# Altium schematic sheet Power.SchDoc: Power
size B; Organization: UCLA High Energy Physics; DocumentNumber: 9; Revision: 2.0; SheetNumber: 9; SheetTotal: 12; CurrentDate: 8/7/2018; ModifiedDate: 8/20/2018; Rule: PcbType=ProtelPcb
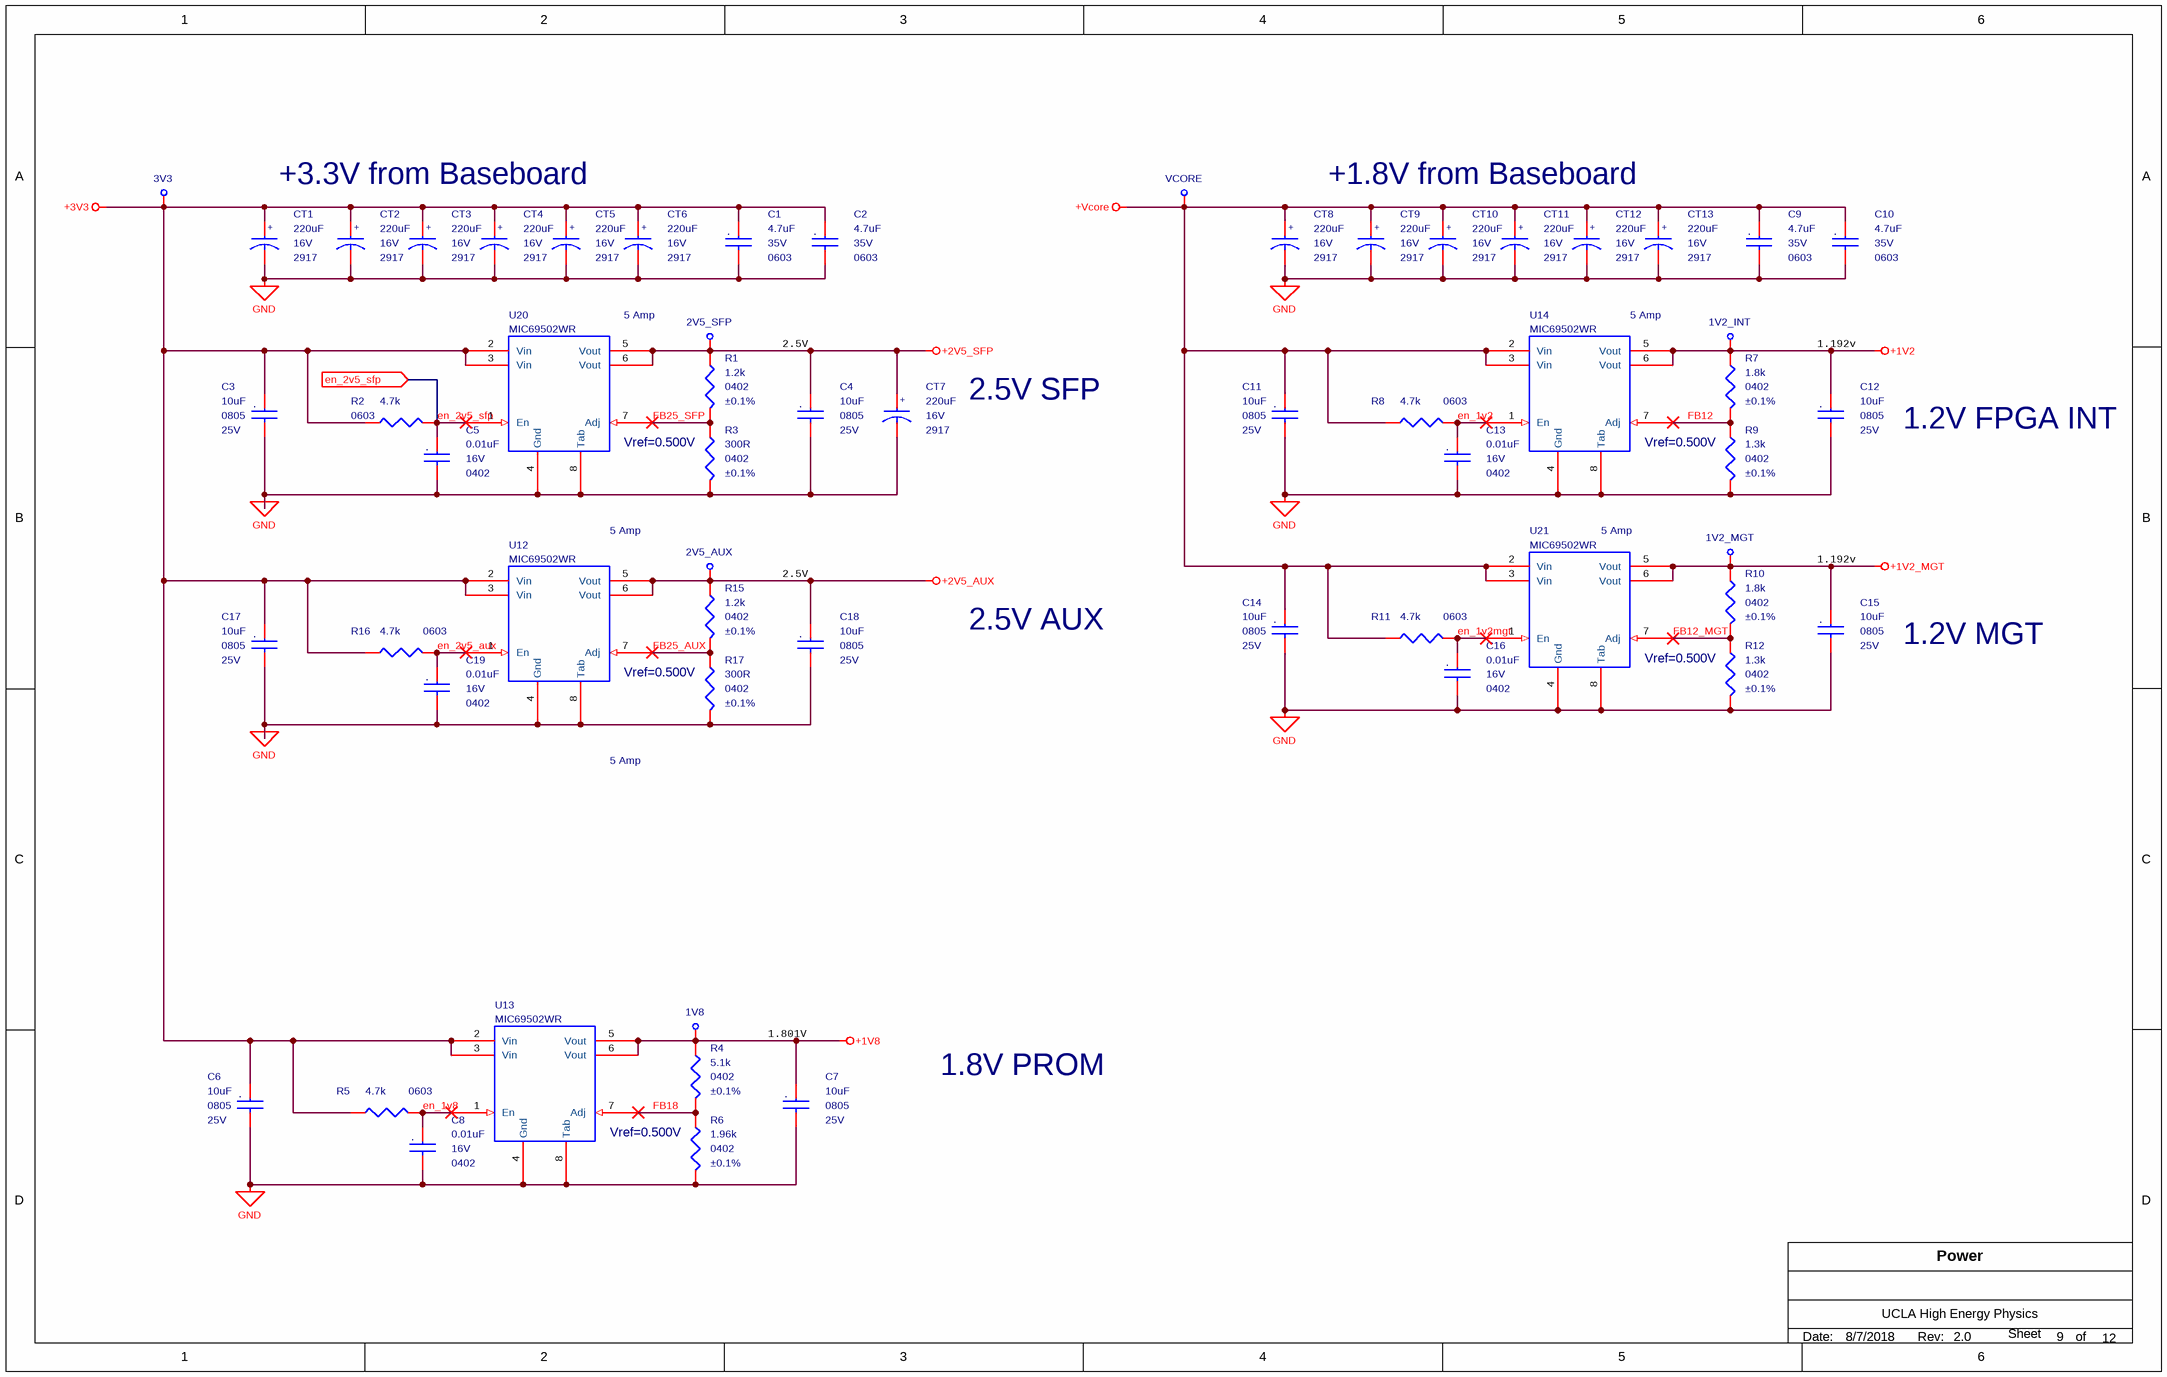
[diagram p0: Power.SchDoc]

## Parts
1V2_INT  Test Point Via  [MC_S6/TH/TPVIA]  (value not drawn)  (no BOM)
1V2_MGT  Test Point Via  [MC_S6/TH/TPVIA]  (value not drawn)  (no BOM)
1V8  Test Point Via  [MC_S6/TH/TPVIA]  (value not drawn)  (no BOM)
2V5_AUX  Test Point Via  [MC_S6/TH/TPVIA]  (value not drawn)  (no BOM)
2V5_SFP  Test Point Via  [MC_S6/TH/TPVIA]  (value not drawn)  (no BOM)
3V3  Test Point Via  [MC_S6/TH/TPVIA]  (value not drawn)  (no BOM)
C1  4.7uF  Voltage - Rated: 35V  package: 0603  [MC_S6/SM/C_0603_IPC]
C2  4.7uF  Voltage - Rated: 35V  package: 0603  [MC_S6/SM/C_0603_IPC]
C3  10uF  Voltage - Rated: 25V  package: 0805  [MC_S6/SM/C_0805_IPC]
C4  10uF  Voltage - Rated: 25V  package: 0805  [MC_S6/SM/C_0805_IPC]
C5  0.01uF  Voltage - Rated: 16V  package: 0402  [MC_S6/SM/C_0402_IPC]
C6  10uF  Voltage - Rated: 25V  package: 0805  [MC_S6/SM/C_0805_IPC]
C7  10uF  Voltage - Rated: 25V  package: 0805  [MC_S6/SM/C_0805_IPC]
C8  0.01uF  Voltage - Rated: 16V  package: 0402  [MC_S6/SM/C_0402_IPC]
C9  4.7uF  Voltage - Rated: 35V  package: 0603  [MC_S6/SM/C_0603_IPC]
C10  4.7uF  Voltage - Rated: 35V  package: 0603  [MC_S6/SM/C_0603_IPC]
C11  10uF  Voltage - Rated: 25V  package: 0805  [MC_S6/SM/C_0805_IPC]
C12  10uF  Voltage - Rated: 25V  package: 0805  [MC_S6/SM/C_0805_IPC]
C13  0.01uF  Voltage - Rated: 16V  package: 0402  [MC_S6/SM/C_0402_IPC]
C14  10uF  Voltage - Rated: 25V  package: 0805  [MC_S6/SM/C_0805_IPC]
C15  10uF  Voltage - Rated: 25V  package: 0805  [MC_S6/SM/C_0805_IPC]
C16  0.01uF  Voltage - Rated: 16V  package: 0402  [MC_S6/SM/C_0402_IPC]
C17  10uF  Voltage - Rated: 25V  package: 0805  [MC_S6/SM/C_0805_IPC]
C18  10uF  Voltage - Rated: 25V  package: 0805  [MC_S6/SM/C_0805_IPC]
C19  0.01uF  Voltage - Rated: 16V  package: 0402  [MC_S6/SM/C_0402_IPC]
CT1  220uF  Voltage - Rated: 16V  package: 2917  [MC_S6/SM/CT_2917_D]
CT2  220uF  Voltage - Rated: 16V  package: 2917  [MC_S6/SM/CT_2917_D]
CT3  220uF  Voltage - Rated: 16V  package: 2917  [MC_S6/SM/CT_2917_D]
CT4  220uF  Voltage - Rated: 16V  package: 2917  [MC_S6/SM/CT_2917_D]
CT5  220uF  Voltage - Rated: 16V  package: 2917  [MC_S6/SM/CT_2917_D]
CT6  220uF  Voltage - Rated: 16V  package: 2917  [MC_S6/SM/CT_2917_D]
CT7  220uF  Voltage - Rated: 16V  package: 2917  [MC_S6/SM/CT_2917_D]
CT8  220uF  Voltage - Rated: 16V  package: 2917  [MC_S6/SM/CT_2917_D]
CT9  220uF  Voltage - Rated: 16V  package: 2917  [MC_S6/SM/CT_2917_D]
CT10  220uF  Voltage - Rated: 16V  package: 2917  [MC_S6/SM/CT_2917_D]
CT11  220uF  Voltage - Rated: 16V  package: 2917  [MC_S6/SM/CT_2917_D]
CT12  220uF  Voltage - Rated: 16V  package: 2917  [MC_S6/SM/CT_2917_D]
CT13  220uF  Voltage - Rated: 16V  package: 2917  [MC_S6/SM/CT_2917_D]
R1  1.2k  Tolerance: ±0.1%  package: 0402  [MC_S6/SM/R_0402_IPC]
R2  4.7k  Supplier Device Package: 0603  [MC_S6/SM/R_0603_IPC]
R3  300R  Tolerance: ±0.1%  package: 0402  [MC_S6/SM/R_0402_IPC]
R4  5.1k  Tolerance: ±0.1%  Supplier Device Package: 0402  [MC_S6/SM/R_0402_IPC]
R5  4.7k  Supplier Device Package: 0603  [MC_S6/SM/R_0603_IPC]
R6  1.96k  Tolerance: ±0.1%  package: 0402  [MC_S6/SM/R_0402_IPC]
R7  1.8k  Tolerance: ±0.1%  package: 0402  [MC_S6/SM/R_0402_IPC]
R8  4.7k  Supplier Device Package: 0603  [MC_S6/SM/R_0603_IPC]
R9  1.3k  Tolerance: ±0.1%  Supplier Device Package: 0402  [MC_S6/SM/R_0402_IPC]
R10  1.8k  Tolerance: ±0.1%  Supplier Device Package: 0402  [MC_S6/SM/R_0402_IPC]
R11  4.7k  Supplier Device Package: 0603  [MC_S6/SM/R_0603_IPC]
R12  1.3k  Tolerance: ±0.1%  Supplier Device Package: 0402  [MC_S6/SM/R_0402_IPC]
R15  1.2k  Tolerance: ±0.1%  package: 0402  [MC_S6/SM/R_0402_IPC]
R16  4.7k  Supplier Device Package: 0603  [MC_S6/SM/R_0603_IPC]
R17  300R  Tolerance: ±0.1%  package: 0402  [MC_S6/SM/R_0402_IPC]
U12  MIC69502WR  [MC_S6/SM/SPAK7]
U13  MIC69502WR  [MC_S6/SM/SPAK7]
U14  MIC69502WR  [MC_S6/SM/SPAK7]
U20  MIC69502WR  [MC_S6/SM/SPAK7]
U21  MIC69502WR  [MC_S6/SM/SPAK7]
VCORE  Test Point Via  [MC_S6/TH/TPVIA]  (value not drawn)  (no BOM)

## Ports
en_2v5_sfp (in)

## Nets
+1V2: 1V2_INT.1(In) C12.1 R7.1 U14.5(Vout) U14.6(Vout)
+1V2_MGT: 1V2_MGT.1(In) C15.1 R10.1 U21.5(Vout) U21.6(Vout)
+1V8: 1V8.1(In) C7.1 R4.1 U13.5(Vout) U13.6(Vout)
+2V5_AUX: 2V5_AUX.1(In) C18.1 R15.1 U12.5(Vout) U12.6(Vout)
+2V5_SFP: 2V5_SFP.1(In) C4.1 CT7.1 R1.1 U20.5(Vout) U20.6(Vout)
+3V3: 3V3.1(In) C1.1 C2.1 C3.1 C6.1 C17.1 CT1.1 CT2.1 CT3.1 CT4.1 CT5.1 CT6.1 R2.1 R5.1 R16.1 U12.2(Vin) U12.3(Vin) U13.2(Vin) U13.3(Vin) U20.2(Vin) U20.3(Vin)
+Vcore: C9.1 C10.1 C11.1 C14.1 CT8.1 CT9.1 CT10.1 CT11.1 CT12.1 CT13.1 R8.1 R11.1 U14.2(Vin) U14.3(Vin) U21.2(Vin) U21.3(Vin) VCORE.1(In)
GND: C1.2 C2.2 C3.2 C4.2 C5.2 C6.2 C7.2 C8.2 C9.2 C10.2 C11.2 C12.2 C13.2 C14.2 C15.2 C16.2 C17.2 C18.2 C19.2 CT1.2 CT2.2 CT3.2 CT4.2 CT5.2 CT6.2 CT7.2 CT8.2 CT9.2 CT10.2 CT11.2 CT12.2 CT13.2 R3.2 R6.2 R9.2 R12.2 R17.2 U12.4(Gnd) U12.8(Tab) U13.4(Gnd) U13.8(Tab) U14.4(Gnd) U14.8(Tab) U20.4(Gnd) U20.8(Tab) U21.4(Gnd) U21.8(Tab)
en_1v2: C13.1 R8.2 U14.1(En)
en_1v2mgt: C16.1 R11.2 U21.1(En)
en_1v8: C8.1 R5.2 U13.1(En)
en_2v5_aux: C19.1 R16.2 U12.1(En)
en_2v5_sfp: C5.1 R2.2 U20.1(En) ; port en_2v5_sfp
FB12: R7.2 R9.1 U14.7(Adj)
FB12_MGT: R10.2 R12.1 U21.7(Adj)
FB18: R4.2 R6.1 U13.7(Adj)
FB25_AUX: R15.2 R17.1 U12.7(Adj)
FB25_SFP: R1.2 R3.1 U20.7(Adj)

## Notes on the sheet
- +3.3V from Baseboard
- +1.8V from Baseboard
- (near U20) 5 Amp
- (near U14) 5 Amp
- 2.5V
- 1.192v
- Vref=0.500V
- 2.5V SFP
- 1.2V FPGA INT
- (near U12) 5 Amp
- (near U21) 5 Amp
- 2.5V AUX
- 1.2V MGT
- 5 Amp
- 1.801V
- 1.8V PROM
- Date:
- Rev:
- of
- Sheet
- (in symbol C0402C103K4RACTU) .
- (in symbol GRM21BR61E106KA73L) .
- (in symbol GRM188R6YA475KE15D) .
- (in symbol T491D227K016AT) +

## Library data of the parts
1V2_INT 1V2_MGT 1V8 2V5_AUX 2V5_SFP 3V3 VCORE = TPVIA: COMPSIDE: TOP; COMPGROUP: 0; mfgr: Layout; COMPROT: 0; Package: 90; mfgr_id: TPVIA; mfgr_foot: TPVIA
C1 C2 C9 C10 = GRM188R6YA475KE15D: CAP CER 4.7UF 35V X5R 0603; Manufacturer: Murata; Capacitance: 4.7µF; Tolerance: ±10%; Product Training Modules: High-Cap Multilayer Ceramic Capacitors; Featured Product: GA3 Safety Recognized Capacitors; EDA / CAD Models: Download from Accelerated Designs; Online Catalog: GRM Series; Other Names: 490-7205-2; Supplier 1: Digikey; Manufacturer Part Number: GRM188R6YA475KE15D; Category: Capacitors; Stock 1: 180441; Pricing 1: 1=0.32, 10=0.264, 50=0.1486, 100=0.132, 250=0.099, 500=0.0875, 1000=0.0776 (USD); Packaging: Tape & Reel (TR); Operating Temperature: -55°C ~ 85°C; Mounting Type: Surface Mount, MLCC; Size / Dimension: 0.063" L x 0.031" W (1.60mm x 0.80mm); ComponentLink1URL: https://datasheet.ciiva.com/46444/1769893-46444984.pdf; ComponentLink1Description: https://datasheet.ciiva.com/46444/1769893-46444984.pdf; Supplier 2: Digikey; Stock 2: 180441; Pricing 2: 1=0.32, 10=0.264, 50=0.1486, 100=0.132, 250=0.099, 500=0.0875, 1000=0.0776 (USD); Supplier Part Number 1: 490-7205-1-ND; Supplier Part Number 2: 490-7205-6-ND; Package / Case: 0603 (1608 Metric); Standard Package: 4,000; Family: Ceramic Capacitors; Series: GRM; Temperature Coefficient: X5R; Applications: General Purpose; Thickness (Max): 0.031" (0.80mm); ComponentLink2URL: https://datasheet.ciiva.com/46444/1769893-46444985.pdf; ComponentLink2Description: https://datasheet.ciiva.com/46444/1769893-46444985.pdf; ComponentLink3URL: https://datasheet.ciiva.com/14906/partnumbering-e-01-14906426.pdf; ComponentLink3Description: https://datasheet.ciiva.com/14906/partnumbering-e-01-14906426.pdf; ComponentLink4URL: https://datasheet.ciiva.com/14906/partnumbering-e-01-14906427.pdf; ComponentLink4Description: https://datasheet.ciiva.com/14906/partnumbering-e-01-14906427.pdf; ComponentLink5URL: https://datasheet.ciiva.com/14906/partnumbering-e-01-14906428.pdf; ComponentLink5Description: https://datasheet.ciiva.com/14906/partnumbering-e-01-14906428.pdf
C3 C4 C6 C7 C11 C12 C14 C15 C17 C18 = GRM21BR61E106KA73L: CAP CER 10UF 25V X5R 0805; Manufacturer: Murata Electronics North America; Capacitance: 10µF; Tolerance: ±10%; Supplier 1: Digi-Key; Manufacturer Part Number: GRM21BR61E106KA73L; RoHS: RoHS Compliant; Category: Capacitors; Stock 1: 607428; Pricing 1: 1=0.19, 10=0.13, 50=0.0748, 100=0.0618, 250=0.052, 500=0.04356, 1000=0.03575 (USD); Packaging: Cut Tape (CT); Part Status: Active; Temperature Coefficient: X5R; Operating Temperature: -55°C ~ 85°C; Features: -; Ratings: -; Applications: General Purpose; Mounting Type: Surface Mount, MLCC; Package / Case: 0805 (2012 Metric); Size / Dimension: 0.079" L x 0.049" W (2.00mm x 1.25mm); Height - Seated (Max): -; Thickness (Max): 0.053" (1.35mm); Lead Spacing: -; Lead Style: -; ComponentLink1URL: http://www.murata.com/~/media/webrenewal/support/library/catalog/products/capacitor/mlcc/c02e.pdf; ComponentLink1Description: http://www.murata.com/~/media/webrenewal/support/library/catalog/products/capacitor/mlcc/c02e.pdf; Supplier 2: Digi-Key; Supplier Part Number 1: 490-5523-1-ND; Supplier Part Number 2: 490-5523-6-ND
C5 C8 C13 C16 C19 = C0402C103K4RACTU: CAP CER 10nF 16V X7R 0402; Manufacturer: KEMET; Capacitance: 10000pF; Tolerance: ±10%; Supplier 1: Digi-Key; Manufacturer Part Number: C0402C103K4RACTU; RoHS: RoHS Compliant; Category: Capacitors; Stock 1: 605739; Pricing 1: 1=0.1, 10=0.02, 25=0.0144, 50=0.0108, 100=0.0088, 250=0.00732, 500=0.00626, 1000=0.00492, 5000=0.00412 (USD); Packaging: Cut Tape (CT); Part Status: Active; Temperature Coefficient: X7R; Operating Temperature: -55°C ~ 125°C; Features: -; Ratings: -; Applications: General Purpose; Failure Rate: -; Mounting Type: Surface Mount, MLCC; Package / Case: 0402 (1005 Metric); Size / Dimension: 0.039" L x 0.020" W (1.00mm x 0.50mm); Height - Seated (Max): -; Thickness (Max): 0.022" (0.55mm); Lead Spacing: -; Lead Style: -; ComponentLink1URL: http://www.kemet.com/docfinder?Partnumber=C0402C103K4RACTU; ComponentLink1Description: http://www.kemet.com/docfinder?Partnumber=C0402C103K4RACTU; Supplier 2: Digi-Key; Stock 2: 605739; Pricing 2: 1=0.1, 10=0.02, 25=0.0144, 50=0.0108, 100=0.0088, 250=0.00732, 500=0.00626, 1000=0.00492, 5000=0.00412 (USD); Supplier Part Number 1: 399-1038-1-ND; Supplier Part Number 2: 399-1038-6-ND
CT1-CT13 = T491D227K016AT: CAP TANT 220UF 16V 10% 2917; Manufacturer: KEMET; Manufacturer Size Code: D; Capacitance: 220µF; ESR (Equivalent Series Resistance): 500 mOhm; Lifetime @ Temp.: 2000 Hrs @ 85°C; Supplier 1: Digi-Key; Manufacturer Part Number: T491D227K016AT; RoHS: RoHS Compliant; Category: Capacitors; Stock 1: 48724; Pricing 1: 1=1.28, 10=1.009, 25=0.9248, 50=0.8744, 100=0.7568, 250=0.67268 (USD); Packaging: Cut Tape (CT); Part Status: Active; Tolerance: ±10%; Type: Molded; Operating Temperature: -55°C ~ 125°C; Mounting Type: Surface Mount; Package / Case: 2917 (7343 Metric); Size / Dimension: 0.287" L x 0.169" W (7.30mm x 4.30mm); Height - Seated (Max): 0.122" (3.10mm); Lead Spacing: -; Features: General Purpose; Failure Rate: -; ComponentLink1URL: http://www.kemet.com/Lists/ProductCatalog/Attachments/254/KEM_T2005_T491.pdf; ComponentLink1Description: http://www.kemet.com/Lists/ProductCatalog/Attachments/254/KEM_T2005_T491.pdf; Supplier 2: Digi-Key; Stock 2: 48724; Pricing 2: 1=1.28, 10=1.009, 25=0.9248, 50=0.8744, 100=0.7568, 250=0.67268 (USD); Supplier Part Number 1: 399-10429-1-ND; Supplier Part Number 2: 399-10429-6-ND
R1 R15 = ERA-2AEB122X: RES SMD 1.2K OHM 0.1% 1/16W 0402; Manufacturer: Panasonic Electronic Components; Power (Watts): 0.063W, 1/16W; Temperature Coefficient: ±25ppm/°C; Supplier 1: Digi-Key; Manufacturer Part Number: ERA-2AEB122X; RoHS: RoHS Compliant; Category: Resistors; Stock 1: 25790; Pricing 1: 1=0.45, 10=0.321, 100=0.1283, 1000=0.06322, 2500=0.05858, 5000=0.053 (USD); Packaging: Cut Tape (CT); Part Status: Active; Composition: Thin Film; Features: Automotive AEC-Q200; Operating Temperature: -55°C ~ 155°C; Package / Case: 0402 (1005 Metric); Size / Dimension: 0.039" L x 0.020" W (1.00mm x 0.50mm); Height - Seated (Max): 0.016" (0.40mm); Failure Rate: -; ComponentLink1URL: https://industrial.panasonic.com/cdbs/www-data/pdf/RDM0000/AOA0000C307.pdf; ComponentLink1Description: https://industrial.panasonic.com/cdbs/www-data/pdf/RDM0000/AOA0000C307.pdf; Supplier 2: Digi-Key; Stock 2: 25790; Pricing 2: 1=0.45, 10=0.321, 100=0.1283, 1000=0.06322, 2500=0.05858, 5000=0.053 (USD); Supplier Part Number 1: P1.2KDCCT-ND; Supplier Part Number 2: P1.2KDCDKR-ND; Supplier Device Package: 0402
R2 R5 R8 R11 R16 = CR0603-FX-4701ELF: RES SMD 4.7K OHM 1% 1/10W 0603; Manufacturer: Bourns Inc.; Power (Watts): 0.1W, 1/10W; Temperature Coefficient: ±100ppm/°C; Tolerance: ±1%; Supplier 1: Digi-Key; Manufacturer Part Number: CR0603-FX-4701ELF; RoHS: RoHS Compliant; Category: Resistors; Stock 1: 43560; Pricing 1: 1=0.1, 10=0.021, 100=0.0086, 1000=0.00385, 2500=0.00334 (USD); Packaging: Cut Tape (CT); Part Status: Active; Resistance (Ohms): 4.7k; Composition: Thick Film; Features: Moisture Resistant; Operating Temperature: -55°C ~ 155°C; Package / Case: 0603 (1608 Metric); Size / Dimension: 0.063" L x 0.031" W (1.60mm x 0.80mm); Height - Seated (Max): 0.022" (0.55mm); Failure Rate: -; ComponentLink1URL: http://www.bourns.com/docs/Product-Datasheets/CHPREZTR.pdf; ComponentLink1Description: http://www.bourns.com/docs/Product-Datasheets/CHPREZTR.pdf; Supplier 2: Digi-Key; Stock 2: 43560; Pricing 2: 1=0.1, 10=0.021, 100=0.0086, 1000=0.00385, 2500=0.00334 (USD); Supplier Part Number 1: CR0603-FX-4701ELFCT-ND; Supplier Part Number 2: CR0603-FX-4701ELFDKR-ND
R3 R17 = ERA-2AEB301X: RES SMD 300 OHM 0.1% 1/16W 0402; Manufacturer: Panasonic Electronic Components; Power (Watts): 0.063W, 1/16W; Temperature Coefficient: ±25ppm/°C; Supplier 1: Digi-Key; Manufacturer Part Number: ERA-2AEB301X; RoHS: RoHS Compliant; Category: Resistors; Stock 1: 31760; Pricing 1: 1=0.45, 10=0.321, 100=0.1283, 1000=0.06322, 2500=0.05858, 5000=0.053 (USD); Packaging: Cut Tape (CT); Part Status: Active; Composition: Thin Film; Features: Automotive AEC-Q200; Operating Temperature: -55°C ~ 155°C; Package / Case: 0402 (1005 Metric); Supplier Device Package: 0402; Size / Dimension: 0.039" L x 0.020" W (1.00mm x 0.50mm); Height - Seated (Max): 0.016" (0.40mm); Failure Rate: -; ComponentLink1URL: https://industrial.panasonic.com/cdbs/www-data/pdf/RDM0000/AOA0000C307.pdf; ComponentLink1Description: https://industrial.panasonic.com/cdbs/www-data/pdf/RDM0000/AOA0000C307.pdf; Supplier 2: Digi-Key; Stock 2: 31760; Pricing 2: 1=0.45, 10=0.321, 100=0.1283, 1000=0.06322, 2500=0.05858, 5000=0.053 (USD); Supplier Part Number 1: P300DCCT-ND; Supplier Part Number 2: P300DCDKR-ND
R4 = ERA-2AEB512X: RES SMD 5.1K OHM 0.1% 1/16W 0402; Manufacturer: Panasonic Electronic Components; Power (Watts): 0.063W, 1/16W; Temperature Coefficient: ±25ppm/°C; Supplier 1: Digi-Key; Manufacturer Part Number: ERA-2AEB512X; RoHS: RoHS Compliant; Category: Resistors; Stock 1: 26098; Pricing 1: 1=0.61, 50=0.238, 100=0.1913, 250=0.14876, 500=0.1122, 1000=0.0867, 5000=0.0646 (USD); Packaging: Cut Tape (CT); Part Status: Active; Resistance (Ohms): 5.1k; Composition: Thin Film; Features: Automotive AEC-Q200; Operating Temperature: -55°C ~ 155°C; Package / Case: 0402 (1005 Metric); Size / Dimension: 0.039" L x 0.020" W (1.00mm x 0.50mm); Height - Seated (Max): 0.016" (0.40mm); Failure Rate: -; ComponentLink1URL: https://industrial.panasonic.com/cdbs/www-data/pdf/RDA0000/AOA0000C237.pdf; ComponentLink1Description: https://industrial.panasonic.com/cdbs/www-data/pdf/RDA0000/AOA0000C237.pdf; Supplier 2: Digi-Key; Stock 2: 26098; Pricing 2: 1=0.61, 50=0.238, 100=0.1913, 250=0.14876, 500=0.1122, 1000=0.0867, 5000=0.0646 (USD); Supplier Part Number 1: P5.1KDCCT-ND; Supplier Part Number 2: P5.1KDCDKR-ND; Number of Terminations: 2
R6 = ERA-2AEB1961X: RES SMD 1.96K OHM 0.1% 1/16W 0402; Manufacturer: Panasonic Electronic Components; Power (Watts): 0.063W, 1/16W; Temperature Coefficient: ±25ppm/°C; Supplier 1: Digi-Key; Manufacturer Part Number: ERA-2AEB1961X; RoHS: RoHS Compliant; Category: Resistors; Stock 1: 36796; Pricing 1: 1=0.45, 10=0.321, 100=0.1283, 1000=0.06322, 2500=0.05858, 5000=0.053 (USD); Packaging: Cut Tape (CT); Part Status: Active; Composition: Thin Film; Features: Automotive AEC-Q200; Operating Temperature: -55°C ~ 155°C; Package / Case: 0402 (1005 Metric); Size / Dimension: 0.039" L x 0.020" W (1.00mm x 0.50mm); Height - Seated (Max): 0.016" (0.40mm); Failure Rate: -; ComponentLink1URL: https://industrial.panasonic.com/cdbs/www-data/pdf/RDM0000/AOA0000C307.pdf; ComponentLink1Description: https://industrial.panasonic.com/cdbs/www-data/pdf/RDM0000/AOA0000C307.pdf; Supplier 2: Digi-Key; Stock 2: 36796; Pricing 2: 1=0.45, 10=0.321, 100=0.1283, 1000=0.06322, 2500=0.05858, 5000=0.053 (USD); Supplier Part Number 1: P1.96KDCCT-ND; Supplier Part Number 2: P1.96KDCDKR-ND; Supplier Device Package: 0402
R7 R10 = ERA-2AEB182X: RES SMD 1.8k OHM 0.1% 1/16W 0402; Manufacturer: Panasonic Electronic Components; Power (Watts): 0.063W, 1/16W; Temperature Coefficient: ±25ppm/°C; Supplier 1: Digi-Key; Manufacturer Part Number: ERA-2AEB182X; RoHS: RoHS Compliant; Category: Resistors; Packaging: Cut Tape (CT); Part Status: Active; Composition: Thin Film; Features: Automotive AEC-Q200; Operating Temperature: -55°C ~ 155°C; Package / Case: 0402 (1005 Metric); Size / Dimension: 0.039" L x 0.020" W (1.00mm x 0.50mm); Height - Seated (Max): 0.016" (0.40mm); Failure Rate: -; Supplier 2: Digi-Key; Supplier Part Number 1: P1.8KDCCT-ND; Supplier Part Number 2: P1.8KDCDKR-ND
  R7: Stock 1: 43633; Pricing 1: 1=0.45, 10=0.321, 100=0.1283, 1000=0.06322, 2500=0.05858, 5000=0.053 (USD); ComponentLink1URL: https://industrial.panasonic.com/cdbs/www-data/pdf/RDM0000/AOA0000C307.pdf; ComponentLink1Description: https://industrial.panasonic.com/cdbs/www-data/pdf/RDM0000/AOA0000C307.pdf; Stock 2: 43633; Pricing 2: 1=0.45, 10=0.321, 100=0.1283, 1000=0.06322, 2500=0.05858, 5000=0.053 (USD); Supplier Device Package: 0402
  R10: Stock 1: 39375; Pricing 1: 1=0.6, 50=0.2484, 100=0.2052, 250=0.162, 500=0.13824, 1000=0.10368, 5000=0.07776 (USD); Resistance (Ohms): 1.8k; ComponentLink1URL: https://industrial.panasonic.com/cdbs/www-data/pdf/RDA0000/AOA0000C237.pdf; ComponentLink1Description: https://industrial.panasonic.com/cdbs/www-data/pdf/RDA0000/AOA0000C237.pdf; Stock 2: 39375; Pricing 2: 1=0.6, 50=0.2484, 100=0.2052, 250=0.162, 500=0.13824, 1000=0.10368, 5000=0.07776 (USD); Number of Terminations: 2
R9 R12 = ERA-2AEB132X: RES SMD 1.3k OHM 0.1% 1/16W 0402; Manufacturer: Panasonic Electronic Components; Power (Watts): 0.063W, 1/16W; Temperature Coefficient: ±25ppm/°C; Supplier 1: Digi-Key; Manufacturer Part Number: ERA-2AEB132X; RoHS: RoHS Compliant; Category: Resistors; Stock 1: 249; Pricing 1: 1=0.45, 10=0.321, 100=0.1283, 1000=0.06322, 2500=0.05858, 5000=0.053 (USD); Packaging: Cut Tape (CT); Part Status: Active; Composition: Thin Film; Features: Automotive AEC-Q200; Operating Temperature: -55°C ~ 155°C; Package / Case: 0402 (1005 Metric); Size / Dimension: 0.039" L x 0.020" W (1.00mm x 0.50mm); Height - Seated (Max): 0.016" (0.40mm); Failure Rate: -; ComponentLink1URL: https://industrial.panasonic.com/cdbs/www-data/pdf/RDM0000/AOA0000C307.pdf; ComponentLink1Description: https://industrial.panasonic.com/cdbs/www-data/pdf/RDM0000/AOA0000C307.pdf; Supplier 2: Digi-Key; Stock 2: 249; Pricing 2: 1=0.45, 10=0.321, 100=0.1283, 1000=0.06322, 2500=0.05858, 5000=0.053 (USD); Supplier Part Number 1: P1.3KDCCT-ND; Supplier Part Number 2: P1.3KDCDKR-ND
U12-U14 U20 U21 = MIC69502WR: IC REG LDO ADJ 5A SPAK-7; Manufacturer: Microchip Technology; Control Features: Enable; Output Configuration: Positive; Output Type: Adjustable; Protection Features: Over Current, Over Temperature; Voltage - Input (Max): 5.5V; Voltage - Output (Min/Fixed): 0.5V; Voltage Dropout (Max): 0.5V @ 5A; Category: Integrated Circuits (ICs); ComponentLink1Description: http://www.microchip.com/mymicrochip/filehandler.aspx?ddocname=en580586; ComponentLink1URL: http://www.microchip.com/mymicrochip/filehandler.aspx?ddocname=en580586; Current - Output: 5A; Manufacturer Part Number: MIC69502WR; Mounting Type: Surface Mount; Operating Temperature: -40°C ~ 125°C; Package / Case: SPak-7 (7 leads + Tab); Packaging: Tube; Part Status: Active; Pricing 1: 1=2.98, 25=2.4884, 100=2.2575 (USD); PSRR: -; RoHS: RoHS Compliant; Stock 1: 2547; Supplier 1: Digi-Key; Supplier Device Package: S-PAK-7; Supplier Part Number 1: 576-1613-ND; Voltage - Output (Max): 5.5V